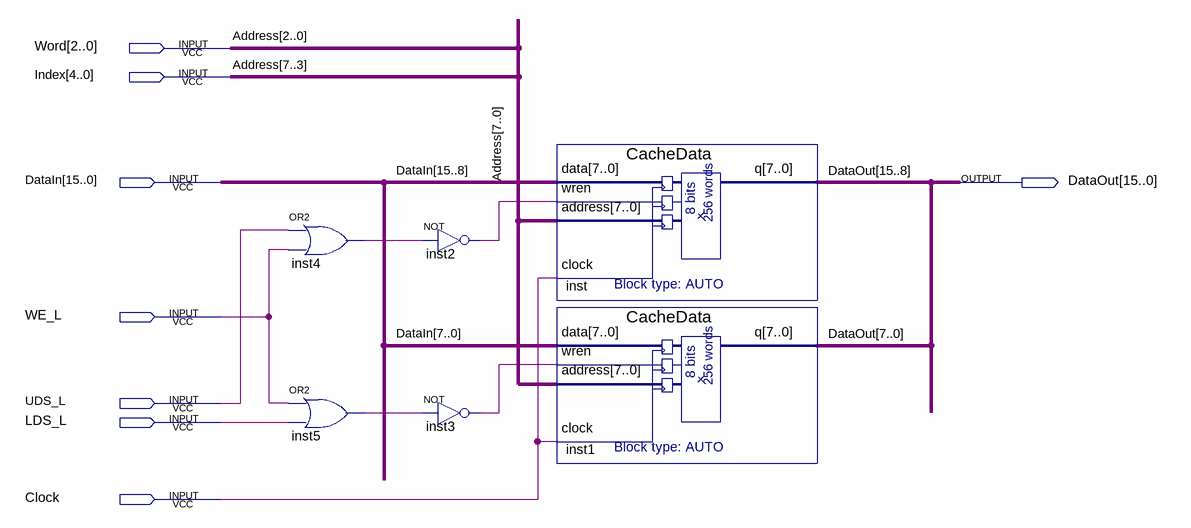
[diagram p0: schematic sheet]
// Quartus schematic CacheDataMemory.bdf as structural Verilog: 6 symbols, 8 pins
module CacheDataMemory (
  input  [2:0] Word,
  input  [4:0] Index,
  input  [15:0] DataIn,
  input  WE_L,
  input  UDS_L,
  input  LDS_L,
  input  Clock,
  output [15:0] DataOut
);

  wire inst2_out, inst3_out, inst4_out, inst5_out;

  or inst4 (inst4_out, UDS_L, WE_L);
  or inst5 (inst5_out, WE_L, LDS_L);
  not inst2 (inst2_out, inst4_out);
  not inst3 (inst3_out, inst5_out);
  CacheData inst (.data(DataIn[15:8]), .wren(inst2_out), .address({Index, Word}), .clock(Clock), .q(DataOut[15:8]));
  CacheData inst1 (.data(DataIn[7:0]), .wren(inst3_out), .address({Index, Word}), .clock(Clock), .q(DataOut[7:0]));

  // Other names for the same wires on the sheet: Address[7:0] = {Index, Word}
endmodule
